# EAGLE design Adafruit Joy Bonnet (EAGLE 6.4)
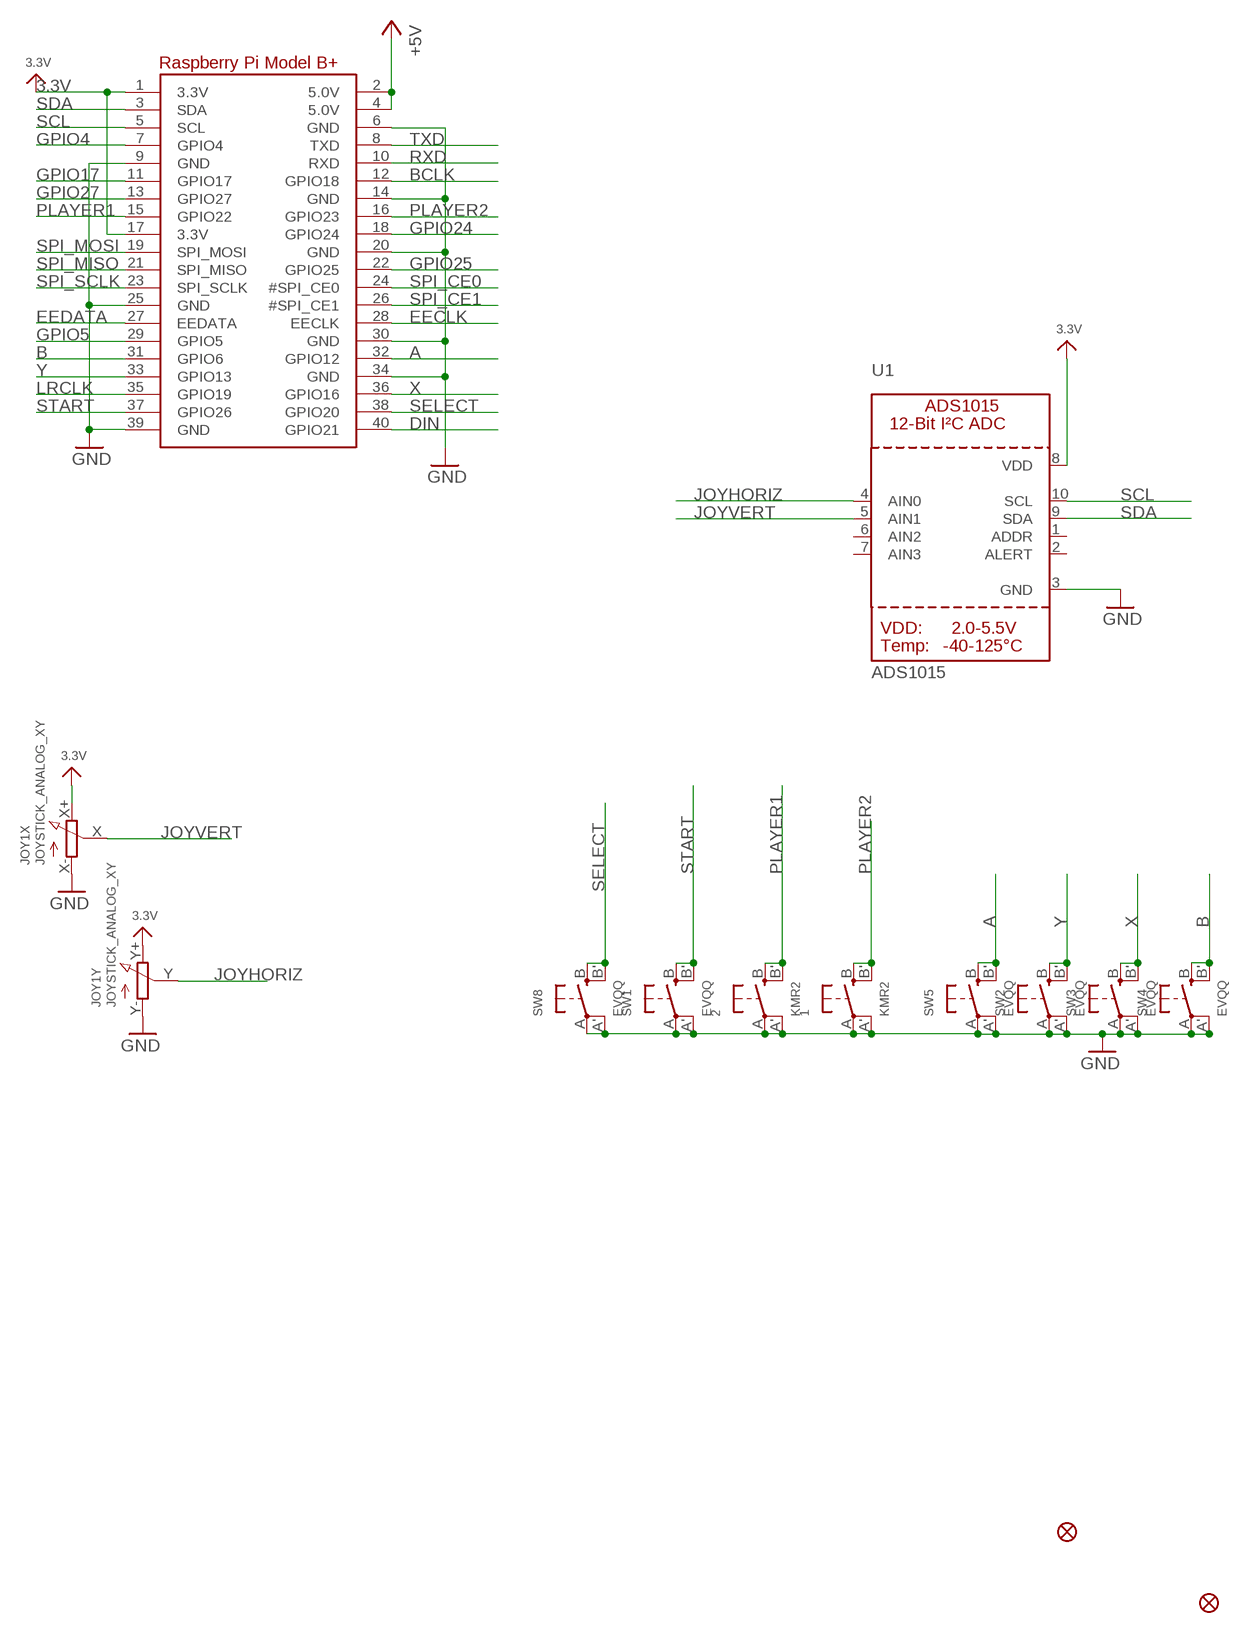
[diagram p0: schematic, sheet 1]

## Parts
1  KMR2  SWITCH_TACT_SMT4.6X2.8  [BTN_KMR2_4.6X2.8]
2  KMR2  SWITCH_TACT_SMT4.6X2.8  [BTN_KMR2_4.6X2.8]
FID2  FIDUCIAL_1MM  [FIDUCIAL_1MM]
FID3  FIDUCIAL_1MM  [FIDUCIAL_1MM]
JOY1  JOYSTICK_ANALOG_XY  [JOYSTICK_ANALOG_MINITHM]
RPI1  RASPBERRYPI_BPLUS_BONNETSMT  [PI_BONNET_SMT]
SW1  EVQQ  SWITCH_TACT_SMT_EVQQ2_SMALL  [EVQ-Q2_SMALLER]
SW2  EVQQ  SWITCH_TACT_SMT_EVQQ2_SMALL  [EVQ-Q2_SMALLER]
SW3  EVQQ  SWITCH_TACT_SMT_EVQQ2_SMALL  [EVQ-Q2_SMALLER]
SW4  EVQQ  SWITCH_TACT_SMT_EVQQ2_SMALL  [EVQ-Q2_SMALLER]
SW5  EVQQ  SWITCH_TACT_SMT_EVQQ2_SMALL  [EVQ-Q2_SMALLER]
SW8  EVQQ  SWITCH_TACT_SMT_EVQQ2_SMALL  [EVQ-Q2_SMALLER]
U1  ADS1015  ADC_ADS1015  [MSOP10]

## Nets
3.3V: JOY1.X+(X:E) JOY1.Y+(Y:E) RPI1.1(3.3V) RPI1.17(3.3V) U1.8(VDD)
+5V: RPI1.2(5.0V) RPI1.4(5.0V)
A: RPI1.32(GPIO12) SW5.B'(S1) SW5.B(S)
B: RPI1.31(GPIO6) SW4.B'(S1) SW4.B(S)
BCLK: RPI1.12(GPIO18)
DIN: RPI1.40(GPIO21)
EECLK: RPI1.28(EECLK)
EEDATA: RPI1.27(EEDATA)
GND: 1.A'(P1) 1.A(P) 2.A'(P1) 2.A(P) JOY1.X-(X:A) JOY1.Y-(Y:A) RPI1.6(GND) RPI1.9(GND) RPI1.14(GND) RPI1.20(GND) RPI1.25(GND) RPI1.30(GND) RPI1.34(GND) RPI1.39(GND) SW1.A'(P1) SW1.A(P) SW2.A'(P1) SW2.A(P) SW3.A'(P1) SW3.A(P) SW4.A'(P1) SW4.A(P) SW5.A'(P1) SW5.A(P) SW8.A'(P1) SW8.A(P) U1.3(GND)
GPIO4: RPI1.7(GPIO4)
GPIO5: RPI1.29(GPIO5)
GPIO17: RPI1.11(GPIO17)
GPIO24: RPI1.18(GPIO24)
GPIO25: RPI1.22(GPIO25)
GPIO27: RPI1.13(GPIO27)
JOYHORIZ: JOY1.Y(Y:S) U1.4(AIN0)
JOYVERT: JOY1.X(X:S) U1.5(AIN1)
LRCLK: RPI1.35(GPIO19)
PLAYER1: 2.B'(S1) 2.B(S) RPI1.15(GPIO22)
PLAYER2: 1.B'(S1) 1.B(S) RPI1.16(GPIO23)
RXD: RPI1.10(RXD)
SCL: RPI1.5(SCL) U1.10(SCL)
SDA: RPI1.3(SDA) U1.9(SDA)
SELECT: RPI1.38(GPIO20) SW8.B'(S1) SW8.B(S)
SPI_CE0: RPI1.24(#SPI_CE0)
SPI_CE1: RPI1.26(#SPI_CE1)
SPI_MISO: RPI1.21(SPI_MISO)
SPI_MOSI: RPI1.19(SPI_MOSI)
SPI_SCLK: RPI1.23(SPI_SCLK)
START: RPI1.37(GPIO26) SW1.B'(S1) SW1.B(S)
TXD: RPI1.8(TXD)
X: RPI1.36(GPIO16) SW3.B'(S1) SW3.B(S)
Y: RPI1.33(GPIO13) SW2.B'(S1) SW2.B(S)
Unconnected: U1.1(ADDR) U1.2(ALERT) U1.6(AIN2) U1.7(AIN3)

## Library data of the parts
1 2 SW1-SW5 SW8 = microbuilder:SWITCH_TACT_SMT: SMT Tact Switches 6x6mm - Digikey: P12940SCT-ND KMR2 (4.6x2.8mm) - Digikey: 401-1426-1-ND EVQ-PQHB55 - Light Touch, 160GF (4.5x4.5mm) - Digikey: P8090SCT-ND KMT0 - KMT021 NGJ LHS (etc.) IP68/Waterproof - Digikey: CKN10289CT-ND
FID2 FID3 = microbuilder:FIDUCIAL: Fiducial Alignment Points Various fiducial points for machine vision alignment.; BOM: EXCLUDE
JOY1 = microbuilder:JOYSTICK_ANALOG_XY
RPI1 = microbuilder:RASPBERRYPI_BPLUS
U1 = microbuilder:ADC_ADS1015: ADS1015 - 12-bit 4-Channel I2C ADC with Internal PGA VDD: 2.0-5.5V Sampling Rate: 3.3ksps Gain Settings: 2/3, 1, 2, 4, 8, 16 I2C Address: ADDR low = 1001000x, ADDR high = 1001001x Internal Comparator The ADS1015 includes an internal comparator that can be set to output a high-level on ALERT when the conversion results exceeeds a pre-defined upper level, and will deassert itself when the level falls below a pre-defined lower threshold level. It can also be set to windowed mode where the ALERT pin will be asserted if the data exceeds the upper threshold or falls below the lower threshold.

## Board
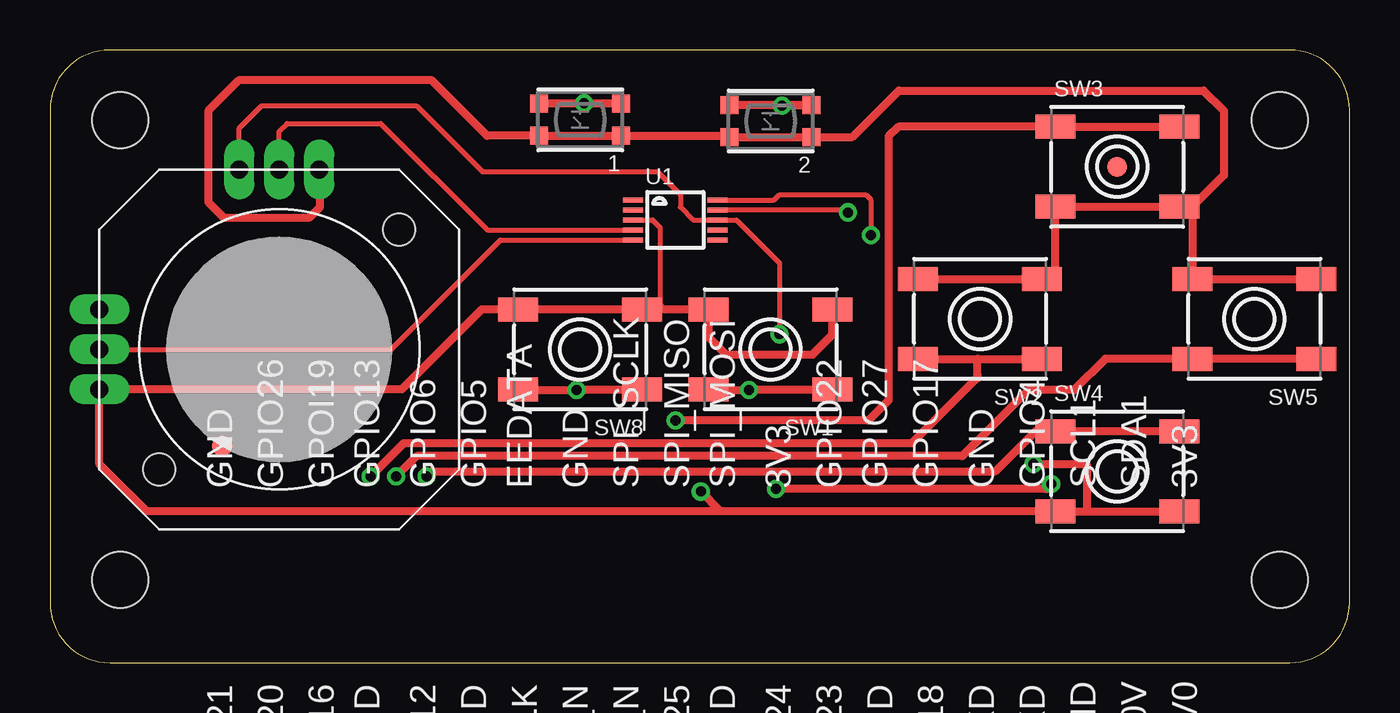
[diagram p1: board, top side]
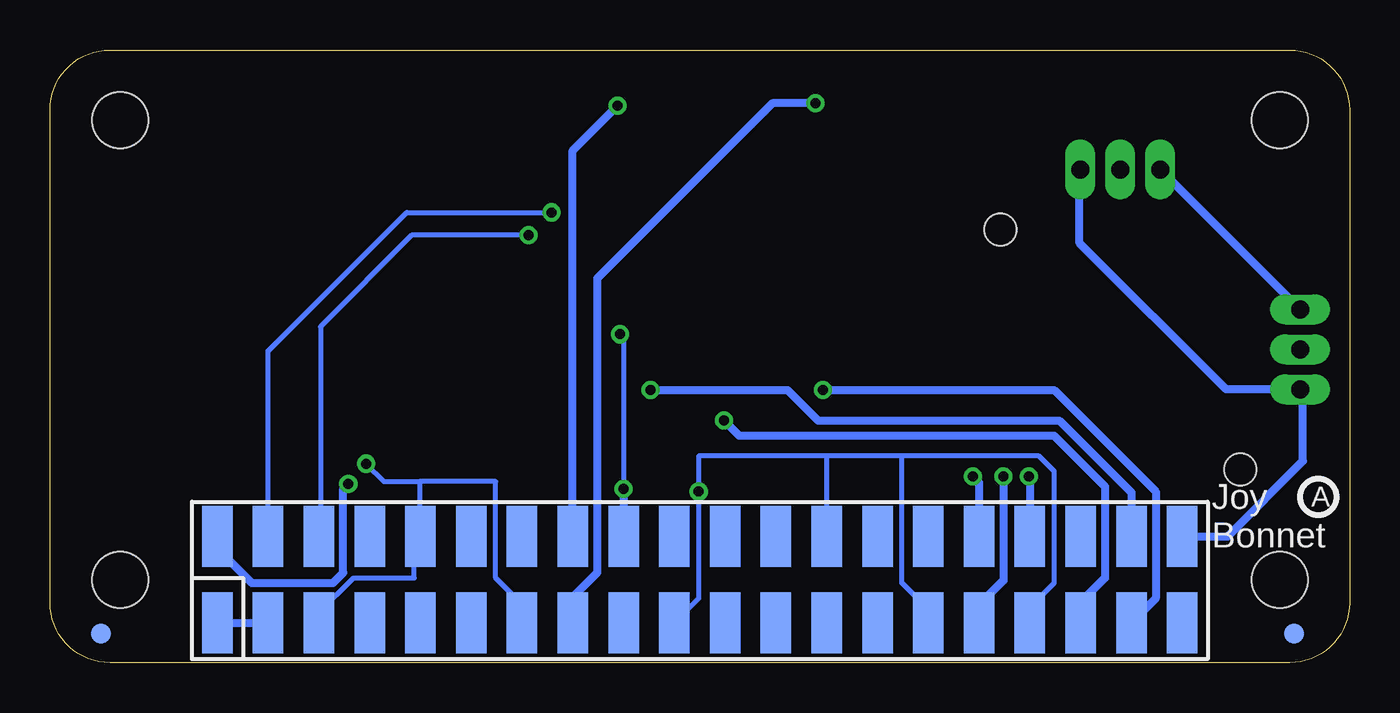
[diagram p2: board, bottom side, seen from below]

Size 65 x 30.66 mm. Coordinates in mm from the lower left corner, seen from the top.
Copper layers (1*16): Top 0.035mm / dielectric 1.5mm / Bottom 0.035mm
Design rules "adafruit *": minimum track width 8mil, minimum drill 15.5mil, track to track 8mil, track to pad 8mil, pad to pad 8mil, via to via 8mil, smd to smd 8mil, copper to edge 10mil, drill to drill 8mil, minimum pad ring 10mil, minimum via ring 8mil, stop-mask expansion 2mil, vias tented up to drill 20mil, thermal gap 10mil

### Footprints (pad centres in the part's own frame; a part is rotated, then mirrored left to right if it is on the bottom)
BTN_KMR2_4.6X2.8 = smd 0.9 x 0.9: A 2.05,0.8; A' -2.05,0.8; B 2.05,-0.8; B' -2.05,-0.8
FIDUCIAL_1MM = smd 1 x 1: 1 0,0
JOYSTICK_ANALOG_MINITHM = drill 0.9 pad 1.5 long: X 0,9; X+ 2,9; X- -2,9; Y 9,0; Y+ 9,2; Y- 9,-2 | hole 1.6: -6,6; 6,-6
PI_BONNET_SMT = smd 1.524 x 3.048 bottom: 1 8.37,24.339; 2 8.37,28.657; 3 10.91,24.339; 4 10.91,28.657; 5 13.45,24.339; 6 13.45,28.657; 7 15.99,24.339; 8 15.99,28.657; 9 18.53,24.339; 10 18.53,28.657; 11 21.07,24.339; 12 21.07,28.657; 13 23.61,24.339; 14 23.61,28.657; 15 26.15,24.339; 16 26.15,28.657; 17 28.69,24.339; 18 28.69,28.657; 19 31.23,24.339; 20 31.23,28.657; 21 33.77,24.339; 22 33.77,28.657; 23 36.31,24.339; 24 36.31,28.657; 25 38.85,24.339; 26 38.85,28.657; 27 41.39,24.339; 28 41.39,28.657; 29 43.93,24.339; 30 43.93,28.657; 31 46.47,24.339; 32 46.47,28.657; 33 49.01,24.339; 34 49.01,28.657; 35 51.55,24.339; 36 51.55,28.657; 37 54.09,24.339; 38 54.09,28.657; 39 56.63,24.339; 40 56.63,28.657 | smd 1 x 1 bottom: 41 2.54,29.21; 42 62.23,29.21 | hole 2.8: 3.5,3.5; 3.5,26.5; 61.5,26.5; 61.5,3.5
EVQ-Q2_SMALLER = smd 2 x 1.2: A -3.1,-2; A' 3.1,-2; B -3.1,2; B' 3.1,2
MSOP10 = smd 0.25 x 1: 1 -1,-2.113; 2 -0.5,-2.113; 3 0,-2.113; 4 0.5,-2.113; 5 1,-2.113; 6 1,2.113; 7 0.5,2.113; 8 0,2.113; 9 -0.5,2.113; 10 -1,2.113

### Placement (x,y rotation side)
1  26.52,27.17 180 top
2  36.04,27.1 180 top
FID2  53.38,24.82 0 top
FID3  8.61,10.85 0 top
JOY1  11.47,15.67 90 top
RPI1  65,30.66 180 top
SW1  36.04,15.67 180 top
SW2  46.52,17.2 180 top
SW3  53.38,24.82 0 top
SW4  53.38,9.58 0 top
SW5  60.24,17.2 180 top
SW8  26.52,15.67 180 top
U1  31.28,22.15 270 top
U$7  [PCBFEAT-REV-040]  1.56,8.31 0 bottom

### Tracks (layer width: path | path; a pad name or v marks a point on that pad's centre or on a via)
3.3V  (via drill 0.5)
  Top 0.254: JOY1.Y+ 9.47,26.76 10.58,27.87 18.33,27.87 21.63,24.56 30.39,24.56 31.54,23.42 31.54,22.79 32.17,22.15 U1.8 34.33,22.15 36.49,19.99 v36.49,16.44
  Top 0.406: v50.08,8.94 49.82,8.69 v36.31,8.69
  Bottom 0.254: v36.49,16.44 36.31,16.26 v36.31,8.69 | 36.31,6.91 RPI1.17
  Bottom 0.406: JOY1.X+ JOY1.Y+ | RPI1.1 56.63,5.72 54.9,3.99 50.84,3.99 50.33,4.5 50.33,8.69 v50.08,8.94 | v36.31,8.69 36.31,6.91
+5V
  Bottom 0.406: RPI1.2 RPI1.4
A  (via drill 0.5)
  Top 0.406: SW5.B SW5.B' 52.78,15.2 51.22,13.64 48.93,13.64 45.63,10.34 18.33,10.34 v17.31,9.32
  Bottom 0.406: v17.31,9.32 17.31,4.12 18.53,2.9 RPI1.32
B  (via drill 0.5)
  Top 0.406: SW4.B' SW4.B 50.25,11.61 49.32,11.61 47.28,9.58 19.09,9.58 v18.84,9.32
  Bottom 0.406: v18.84,9.32 18.53,9.02 RPI1.31
GND  (via drill 0.5)
  Top 0.254: U1.3 30.14,22.15 30.52,21.77 30.52,17.93 30.77,17.67
  Top 0.406: 51.86,7.58 SW4.A 33.54,7.58 | 51.86,7.58 SW4.A' | SW3.A 49.62,22.82 | SW2.A' SW2.A 50.28,19.2 SW3.A | SW3.A SW3.A' 57.14,22.82 | 57.14,22.82 SW5.A' SW5.A | SW1.A 39.14,16.42 38.14,15.42 33.82,15.42 32.94,16.3 SW1.A' 30.77,17.67 SW8.A SW8.A' 21.6,17.67 17.6,13.67 JOY1.X- 2.47,9.94 4.83,7.58 33.54,7.58 | 57.14,22.82 58.71,24.39 58.71,27.61 57.7,28.63 42.46,28.63 40.13,26.3 2.A' 2.A 33.87,26.37 1.A' 1.A 21.86,26.37 19.09,29.14 9.44,29.14 7.91,27.61 7.91,23.04 8.68,22.28 12.99,22.28 13.5,22.79 13.5,24.64 JOY1.Y- | v49.19,9.96 51.86,9.96 51.86,7.58 | 33.54,7.58 v32.55,8.56
  Bottom 0.254: RPI1.34 15.99,2.77 14.77,3.99 14.77,9.58 15.53,10.34 22.39,10.34 | 22.39,10.34 26.15,10.34 | 26.15,10.34 RPI1.25 | RPI1.30 21.07,2.67 22.39,3.99 22.39,10.34 | 26.15,10.34 32.55,10.34 32.55,8.82 | v32.55,8.56 32.55,3.22 RPI1.20 | RPI1.14 41.39,2.92 42.71,4.24 42.71,9.07 46.52,9.07 | 46.52,9.07 46.52,6.32 RPI1.9 46.78,6.02 46.78,4.24 49.82,4.24 51.55,2.52 RPI1.6 | v49.19,9.96 48.3,9.07 46.52,9.07
  Bottom 0.406: JOY1.Y- 13.5,24.64 13.5,21.01 6.17,13.67 JOY1.X- 2.33,13.53 2.33,10.09 6.09,6.32 RPI1.39 | v32.55,8.56 32.55,8.82
JOYHORIZ
  Top 0.254: JOY1.Y 11.47,26.6 11.85,26.98 16.55,26.98 21.88,21.65 U1.4
JOYVERT
  Top 0.254: JOY1.X 17.06,15.67 22.53,21.15 U1.5
PLAYER1  (via drill 0.5)
  Top 0.406: 2.B 2.B' 37.68,27.87 v36.62,27.87
  Bottom 0.406: v36.62,27.87 38.85,25.63 RPI1.15
PLAYER2  (via drill 0.5)
  Top 0.406: 1.B 1.B' 26.73,27.97 v26.71,27.99
  Bottom 0.406: v26.71,27.99 28.87,27.99 37.63,19.23 37.63,4.5 38.85,3.28 RPI1.16
SCL  (via drill 0.5)
  Top 0.254: U1.10 36.22,23.15 36.49,23.42 40.81,23.42 41.06,23.17 v41.06,21.39
  Bottom 0.254: v41.06,21.39 46.9,21.39 51.47,16.82 51.47,6.4 RPI1.5
SDA  (via drill 0.5)
  Top 0.254: v39.92,22.53 39.8,22.65 U1.9
  Bottom 0.254: RPI1.3 54.09,15.6 47.16,22.53 v39.92,22.53
SELECT  (via drill 0.5)
  Top 0.406: 23.06,13.67 SW8.B' 23.45,13.64 v26.33,13.64 29.59,13.64 SW8.B
  Bottom 0.406: v26.33,13.64 14.77,13.64 9.69,8.56 9.69,3.22 RPI1.38
START  (via drill 0.5)
  Top 0.406: SW1.B' 32.98,13.64 v34.96,13.64 39.11,13.64 SW1.B
  Bottom 0.406: v34.96,13.64 28.11,13.64 26.58,12.12 14.52,12.12 10.91,8.51 RPI1.37 10.96,6.37
X  (via drill 0.5)
  Top 0.406: SW3.B' SW3.B 42.43,26.82 41.95,26.34 41.95,13.13 40.93,12.12 v31.28,12.12
  Bottom 0.406: v31.28,12.12 30.52,11.36 14.77,11.36 12.23,8.82 12.23,4.24 13.45,3.03 RPI1.36
Y  (via drill 0.5)
  Top 0.406: v16.04,9.32 17.69,10.98 43.09,10.98 46.39,14.28 | SW2.B' 46.39,15.2 | 46.39,15.2 SW2.B | 46.39,14.23 46.39,14.28 | 46.39,15.2 46.39,14.4 46.39,14.28
  Bottom 0.406: v16.04,9.32 15.99,9.27 RPI1.33

### Text on the board
bPlace: Joy / Bonnet